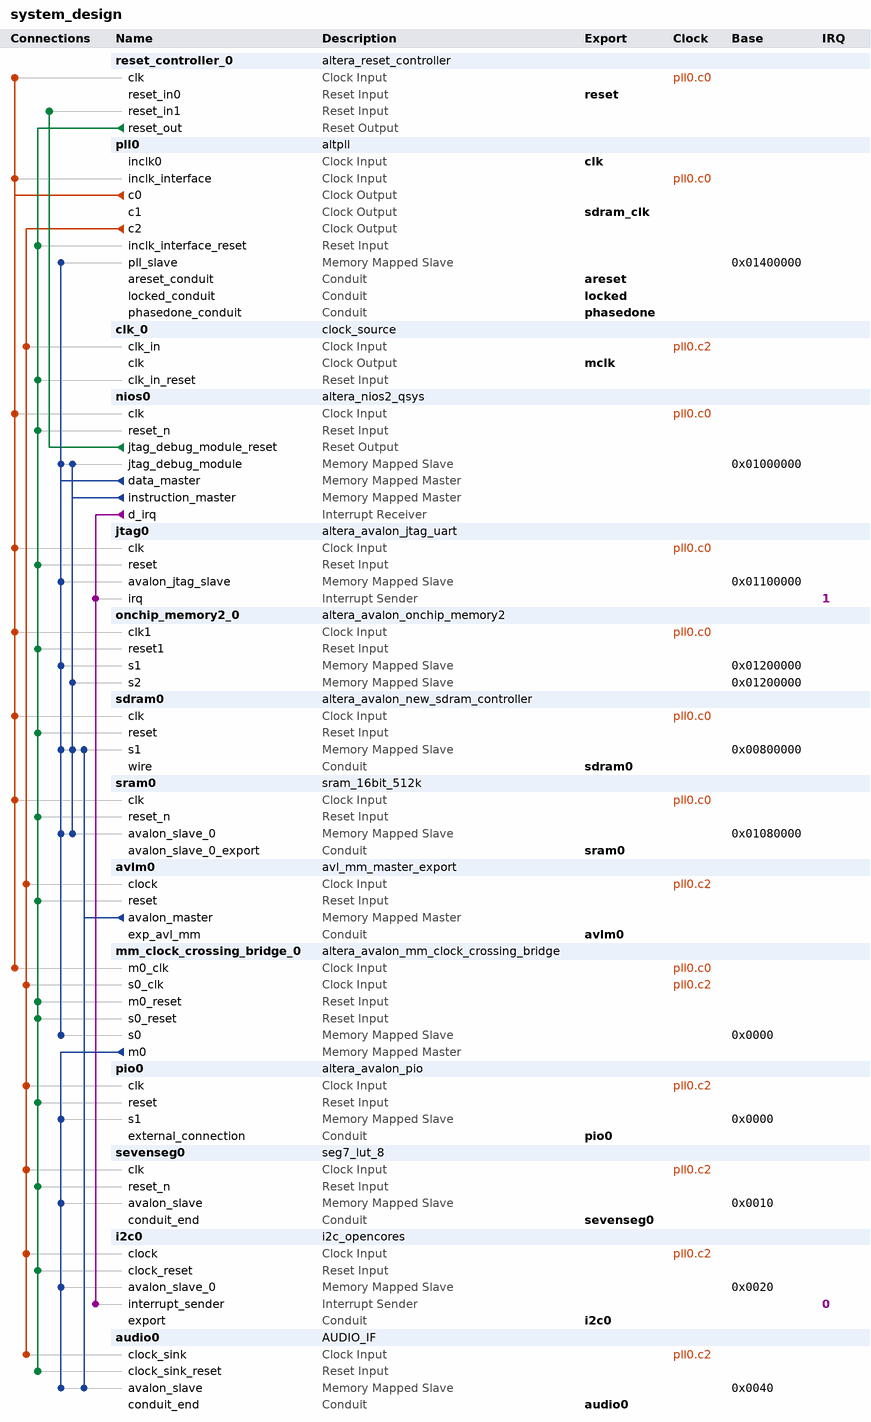
[diagram p0: system contents]
# Platform Designer (Qsys) system system_design, Cyclone II EP2C20F484C7
# Parameters at their usual value, and those the tool derives, are not listed.
package require -exact qsys 13.0
create_system system_design
set_project_property DEVICE_FAMILY {Cyclone II}
set_project_property DEVICE EP2C20F484C7

add_instance reset_controller_0 altera_reset_controller 13.0
set_instance_parameter_value reset_controller_0 NUM_RESET_INPUTS 2
set_instance_parameter_value reset_controller_0 SYNC_DEPTH 2

add_instance pll0 altpll 13.0
set_instance_parameter_value pll0 INCLK0_INPUT_FREQUENCY 41666
set_instance_parameter_value pll0 GATE_LOCK_SIGNAL NO
set_instance_parameter_value pll0 VALID_LOCK_MULTIPLIER 1
set_instance_parameter_value pll0 INVALID_LOCK_MULTIPLIER 5
set_instance_parameter_value pll0 CLK0_MULTIPLY_BY 25
set_instance_parameter_value pll0 CLK1_MULTIPLY_BY 25
set_instance_parameter_value pll0 CLK2_MULTIPLY_BY 1
set_instance_parameter_value pll0 CLK0_DIVIDE_BY 12
set_instance_parameter_value pll0 CLK1_DIVIDE_BY 12
set_instance_parameter_value pll0 CLK2_DIVIDE_BY 2
set_instance_parameter_value pll0 CLK1_PHASE_SHIFT -3333
set_instance_parameter_value pll0 CLK2_PHASE_SHIFT 0
set_instance_parameter_value pll0 CLK1_DUTY_CYCLE 50
set_instance_parameter_value pll0 CLK2_DUTY_CYCLE 50
set_instance_parameter_value pll0 PORT_clk1 PORT_USED
set_instance_parameter_value pll0 PORT_clk2 PORT_USED
set_instance_parameter_value pll0 PORT_clk3 PORT_UNUSED
set_instance_parameter_value pll0 PORT_ARESET PORT_UNUSED
set_instance_parameter_value pll0 PORT_LOCKED PORT_UNUSED
set_instance_parameter_value pll0 AVALON_USE_SEPARATE_SYSCLK YES

add_instance clk_0 clock_source 13.0
set_instance_parameter_value clk_0 clockFrequency 12

add_instance nios0 altera_nios2_qsys 13.0
set_instance_parameter_value nios0 resetSlave onchip_memory2_0.s2
set_instance_parameter_value nios0 mmu_TLBMissExcSlave None
set_instance_parameter_value nios0 exceptionSlave onchip_memory2_0.s2
set_instance_parameter_value nios0 breakSlave nios0.jtag_debug_module
set_instance_parameter_value nios0 impl Fast
set_instance_parameter_value nios0 icache_size 512
set_instance_parameter_value nios0 icache_burstType Sequential
set_instance_parameter_value nios0 dcache_bursts true
set_instance_parameter_value nios0 debug_level Level2
set_instance_parameter_value nios0 dcache_size 512

add_instance jtag0 altera_avalon_jtag_uart 13.0.1.99.2
set_instance_parameter_value jtag0 simInteractiveOptions NO_INTERACTIVE_WINDOWS

add_instance onchip_memory2_0 altera_avalon_onchip_memory2 13.0.1.99.2
set_instance_parameter_value onchip_memory2_0 dataWidth 32
set_instance_parameter_value onchip_memory2_0 dualPort true
set_instance_parameter_value onchip_memory2_0 initMemContent true
set_instance_parameter_value onchip_memory2_0 initializationFileName onchip_mem.hex
set_instance_parameter_value onchip_memory2_0 memorySize 16384
set_instance_parameter_value onchip_memory2_0 singleClockOperation true

add_instance sdram0 altera_avalon_new_sdram_controller 13.0.1.99.2
set_instance_parameter_value sdram0 TAC 5.5
set_instance_parameter_value sdram0 TRCD 20.0
set_instance_parameter_value sdram0 TRP 20.0
set_instance_parameter_value sdram0 casLatency 3
set_instance_parameter_value sdram0 columnWidth 8
set_instance_parameter_value sdram0 dataWidth 16
set_instance_parameter_value sdram0 generateSimulationModel true
set_instance_parameter_value sdram0 model single_Micron_MT48LC4M32B2_7_chip
set_instance_parameter_value sdram0 numberOfBanks 4
set_instance_parameter_value sdram0 numberOfChipSelects 1
set_instance_parameter_value sdram0 powerUpDelay 100.0
set_instance_parameter_value sdram0 refreshPeriod 15.625
set_instance_parameter_value sdram0 rowWidth 12

add_instance sram0 sram_16bit_512k 1.0.2

add_instance avlm0 avl_mm_master_export 1.0

add_instance mm_clock_crossing_bridge_0 altera_avalon_mm_clock_crossing_bridge 13.0
set_instance_parameter_value mm_clock_crossing_bridge_0 DATA_WIDTH 32
set_instance_parameter_value mm_clock_crossing_bridge_0 ADDRESS_WIDTH 7
set_instance_parameter_value mm_clock_crossing_bridge_0 MAX_BURST_SIZE 1
set_instance_parameter_value mm_clock_crossing_bridge_0 COMMAND_FIFO_DEPTH 4
set_instance_parameter_value mm_clock_crossing_bridge_0 RESPONSE_FIFO_DEPTH 4
set_instance_parameter_value mm_clock_crossing_bridge_0 MASTER_SYNC_DEPTH 2
set_instance_parameter_value mm_clock_crossing_bridge_0 SLAVE_SYNC_DEPTH 2

add_instance pio0 altera_avalon_pio 13.0.1.99.2
set_instance_parameter_value pio0 direction Bidir
set_instance_parameter_value pio0 width 32

add_instance sevenseg0 seg7_lut_8 1.0.1

add_instance i2c0 i2c_opencores 13.0

add_instance audio0 AUDIO_IF 1.0

# connections
add_connection pll0.c0 jtag0.clk clock
add_connection pll0.c0 mm_clock_crossing_bridge_0.m0_clk clock
add_connection pll0.c0 nios0.clk clock
add_connection pll0.c0 onchip_memory2_0.clk1 clock
add_connection pll0.c0 pll0.inclk_interface clock
add_connection pll0.c0 reset_controller_0.clk clock
add_connection pll0.c0 sdram0.clk clock
add_connection pll0.c0 sram0.clk clock
add_connection pll0.c2 audio0.clock_sink clock
add_connection pll0.c2 avlm0.clock clock
add_connection pll0.c2 clk_0.clk_in clock
add_connection pll0.c2 i2c0.clock clock
add_connection pll0.c2 mm_clock_crossing_bridge_0.s0_clk clock
add_connection pll0.c2 pio0.clk clock
add_connection pll0.c2 sevenseg0.clk clock
add_connection nios0.jtag_debug_module_reset reset_controller_0.reset_in1 reset
add_connection reset_controller_0.reset_out audio0.clock_sink_reset reset
add_connection reset_controller_0.reset_out avlm0.reset reset
add_connection reset_controller_0.reset_out clk_0.clk_in_reset reset
add_connection reset_controller_0.reset_out i2c0.clock_reset reset
add_connection reset_controller_0.reset_out jtag0.reset reset
add_connection reset_controller_0.reset_out mm_clock_crossing_bridge_0.m0_reset reset
add_connection reset_controller_0.reset_out mm_clock_crossing_bridge_0.s0_reset reset
add_connection reset_controller_0.reset_out nios0.reset_n reset
add_connection reset_controller_0.reset_out onchip_memory2_0.reset1 reset
add_connection reset_controller_0.reset_out pio0.reset reset
add_connection reset_controller_0.reset_out pll0.inclk_interface_reset reset
add_connection reset_controller_0.reset_out sdram0.reset reset
add_connection reset_controller_0.reset_out sevenseg0.reset_n reset
add_connection reset_controller_0.reset_out sram0.reset_n reset
add_connection avlm0.avalon_master audio0.avalon_slave avalon
set_connection_parameter_value avlm0.avalon_master/audio0.avalon_slave baseAddress 0x0040
add_connection avlm0.avalon_master sdram0.s1 avalon
set_connection_parameter_value avlm0.avalon_master/sdram0.s1 baseAddress 0x00800000
add_connection mm_clock_crossing_bridge_0.m0 audio0.avalon_slave avalon
set_connection_parameter_value mm_clock_crossing_bridge_0.m0/audio0.avalon_slave baseAddress 0x0040
add_connection mm_clock_crossing_bridge_0.m0 i2c0.avalon_slave_0 avalon
set_connection_parameter_value mm_clock_crossing_bridge_0.m0/i2c0.avalon_slave_0 baseAddress 0x0020
add_connection mm_clock_crossing_bridge_0.m0 pio0.s1 avalon
set_connection_parameter_value mm_clock_crossing_bridge_0.m0/pio0.s1 baseAddress 0x0000
add_connection mm_clock_crossing_bridge_0.m0 sevenseg0.avalon_slave avalon
set_connection_parameter_value mm_clock_crossing_bridge_0.m0/sevenseg0.avalon_slave baseAddress 0x0010
add_connection nios0.data_master jtag0.avalon_jtag_slave avalon
set_connection_parameter_value nios0.data_master/jtag0.avalon_jtag_slave baseAddress 0x01100000
add_connection nios0.data_master mm_clock_crossing_bridge_0.s0 avalon
set_connection_parameter_value nios0.data_master/mm_clock_crossing_bridge_0.s0 baseAddress 0x0000
add_connection nios0.data_master nios0.jtag_debug_module avalon
set_connection_parameter_value nios0.data_master/nios0.jtag_debug_module baseAddress 0x01000000
add_connection nios0.data_master onchip_memory2_0.s1 avalon
set_connection_parameter_value nios0.data_master/onchip_memory2_0.s1 baseAddress 0x01200000
add_connection nios0.data_master pll0.pll_slave avalon
set_connection_parameter_value nios0.data_master/pll0.pll_slave baseAddress 0x01400000
add_connection nios0.data_master sdram0.s1 avalon
set_connection_parameter_value nios0.data_master/sdram0.s1 baseAddress 0x00800000
add_connection nios0.data_master sram0.avalon_slave_0 avalon
set_connection_parameter_value nios0.data_master/sram0.avalon_slave_0 baseAddress 0x01080000
add_connection nios0.instruction_master nios0.jtag_debug_module avalon
set_connection_parameter_value nios0.instruction_master/nios0.jtag_debug_module baseAddress 0x01000000
add_connection nios0.instruction_master onchip_memory2_0.s2 avalon
set_connection_parameter_value nios0.instruction_master/onchip_memory2_0.s2 baseAddress 0x01200000
add_connection nios0.instruction_master sdram0.s1 avalon
set_connection_parameter_value nios0.instruction_master/sdram0.s1 baseAddress 0x00800000
add_connection nios0.instruction_master sram0.avalon_slave_0 avalon
set_connection_parameter_value nios0.instruction_master/sram0.avalon_slave_0 baseAddress 0x01080000
add_connection nios0.d_irq i2c0.interrupt_sender interrupt
set_connection_parameter_value nios0.d_irq/i2c0.interrupt_sender irqNumber 0
add_connection nios0.d_irq jtag0.irq interrupt
set_connection_parameter_value nios0.d_irq/jtag0.irq irqNumber 1

# exported interfaces
add_interface audio0 conduit end
set_interface_property audio0 EXPORT_OF audio0.conduit_end
add_interface sevenseg0 conduit end
set_interface_property sevenseg0 EXPORT_OF sevenseg0.conduit_end
add_interface sram0 conduit end
set_interface_property sram0 EXPORT_OF sram0.avalon_slave_0_export
add_interface sdram0 conduit end
set_interface_property sdram0 EXPORT_OF sdram0.wire
add_interface avlm0 conduit end
set_interface_property avlm0 EXPORT_OF avlm0.exp_avl_mm
add_interface sdram_clk clock source
set_interface_property sdram_clk EXPORT_OF pll0.c1
add_interface clk clock sink
set_interface_property clk EXPORT_OF pll0.inclk0
add_interface areset conduit end
set_interface_property areset EXPORT_OF pll0.areset_conduit
add_interface locked conduit end
set_interface_property locked EXPORT_OF pll0.locked_conduit
add_interface phasedone conduit end
set_interface_property phasedone EXPORT_OF pll0.phasedone_conduit
add_interface i2c0 conduit end
set_interface_property i2c0 EXPORT_OF i2c0.export
add_interface pio0 conduit end
set_interface_property pio0 EXPORT_OF pio0.external_connection
add_interface mclk clock source
set_interface_property mclk EXPORT_OF clk_0.clk
add_interface reset reset sink
set_interface_property reset EXPORT_OF reset_controller_0.reset_in0

set_interconnect_requirement {$system} qsys_mm.clockCrossingAdapter HANDSHAKE
set_interconnect_requirement {$system} qsys_mm.maxAdditionalLatency 1

save_system system_design.qsys
